# EAGLE design PCB Ruler (EAGLE 6.3)
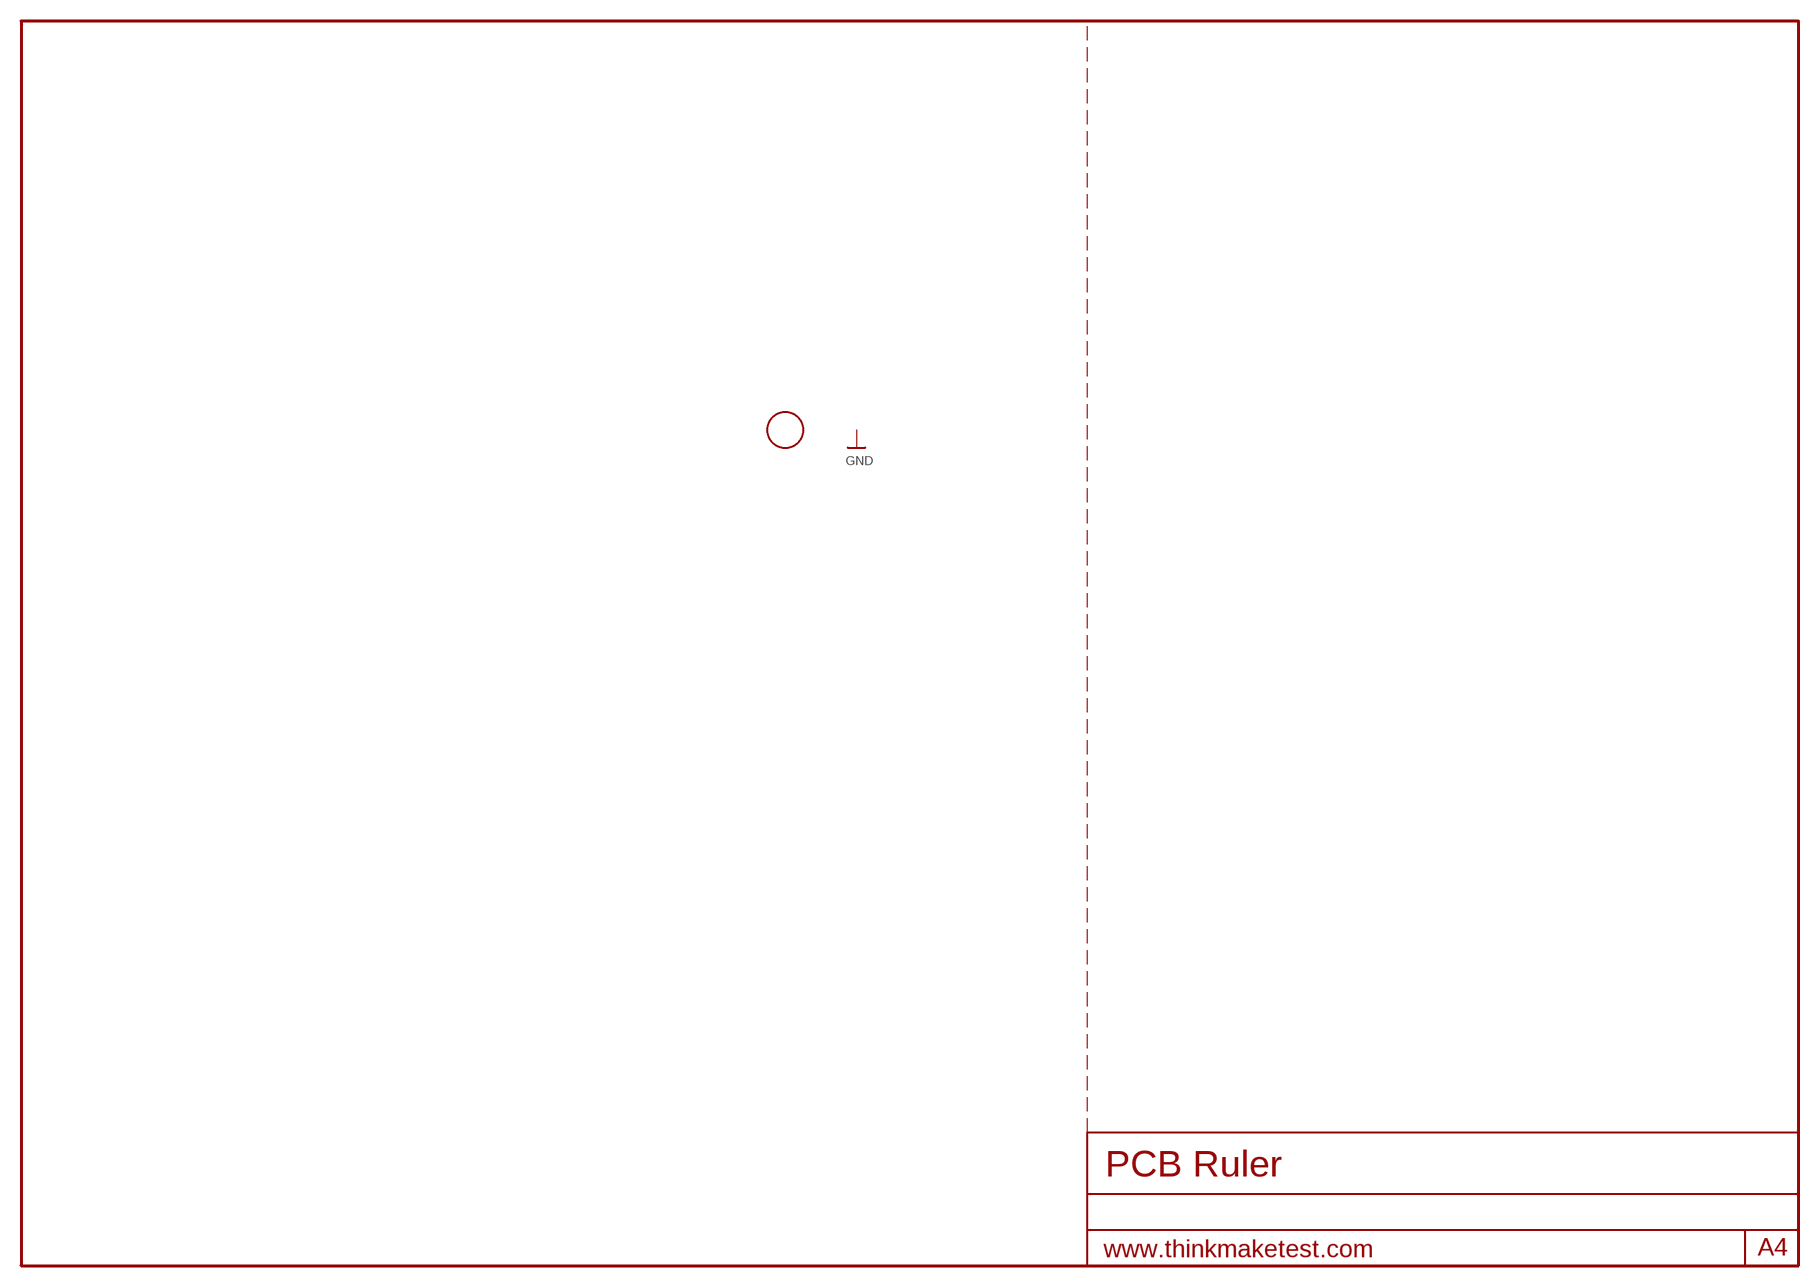
[diagram p0: schematic, sheet 1]

## Parts
U$2  FIDUCIAL  [FIDUCIAL_1MM]

## Library data of the parts
U$2 = adafruit:FIDUCIAL: For use by pick and place machines to calibrate the vision/machine, 1mm By microbuilder.eu

## Board
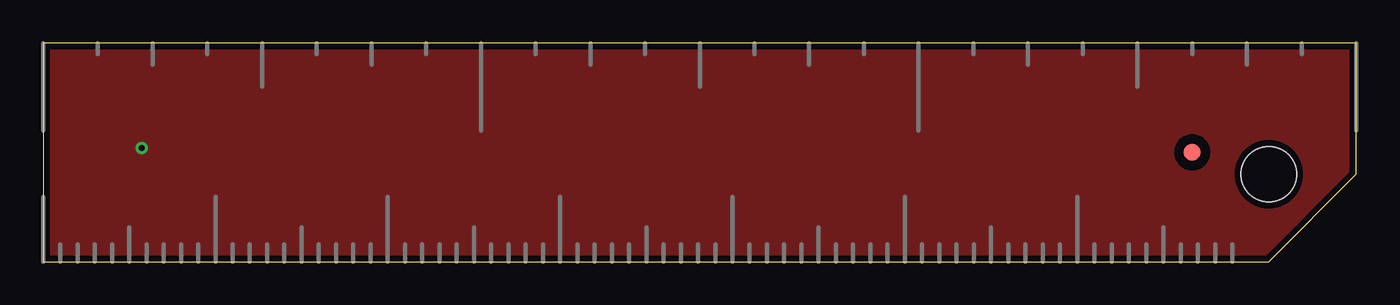
[diagram p1: board, top side]
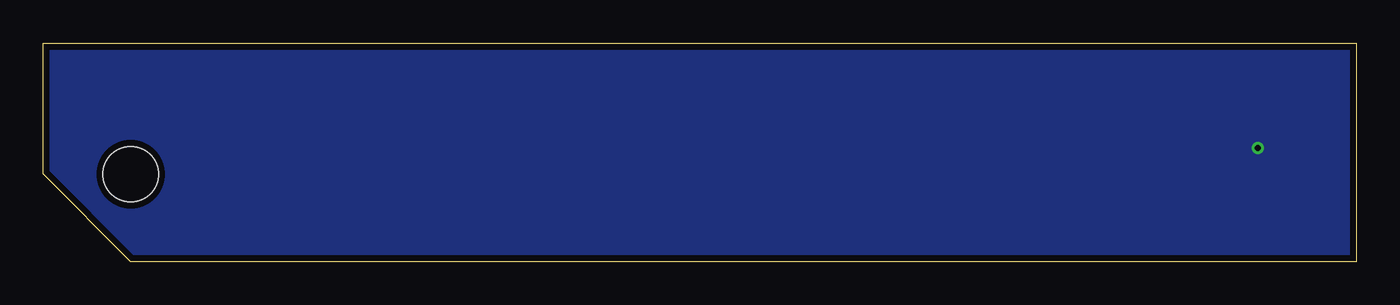
[diagram p2: board, bottom side, seen from below]

Size 76.2 x 12.7 mm. Coordinates in mm from the lower left corner, seen from the top.
Outline: 0,0 71.12,0 76.2,5.08 76.2,12.7 0,12.7 0,0
Copper layers (1*16): Top 0.0356mm / dielectric 1.5011mm / Bottom 0.0356mm
Design rules "OSHPark": minimum track width 6mil, minimum drill 13mil, track to track 6mil, track to pad 6mil, pad to pad 6mil, via to via 6mil, smd to smd 6mil, copper to edge 15mil, drill to drill 6mil, minimum pad ring 7mil, minimum via ring 7mil, stop-mask expansion 4mil, vias tented up to drill 16mil, thermal gap 10mil
Holes 3.2 mm at 71.12,5.08

### Footprints (pad centres in the part's own frame; a part is rotated, then mirrored left to right if it is on the bottom)
FIDUCIAL_1MM = smd 1 x 1: 1 0,0

### Placement (x,y rotation side)
U$2  66.67,6.35 0 top

### Tracks (layer width: path | path; a pad name or v marks a point on that pad's centre or on a via)
GND  (via drill 0.36)
  other vias: 5.71,6.6
  pour Top: 0,0 76.2,0 76.2,12.7 0,12.7
  pour Bottom: 76.2,0 0,0 0,12.7 76.2,12.7

### Text on the board
tDocu: 0 | 1 | 2 | 3 | 0 | 1 | 2 | 3 | 4 | 5 | 6